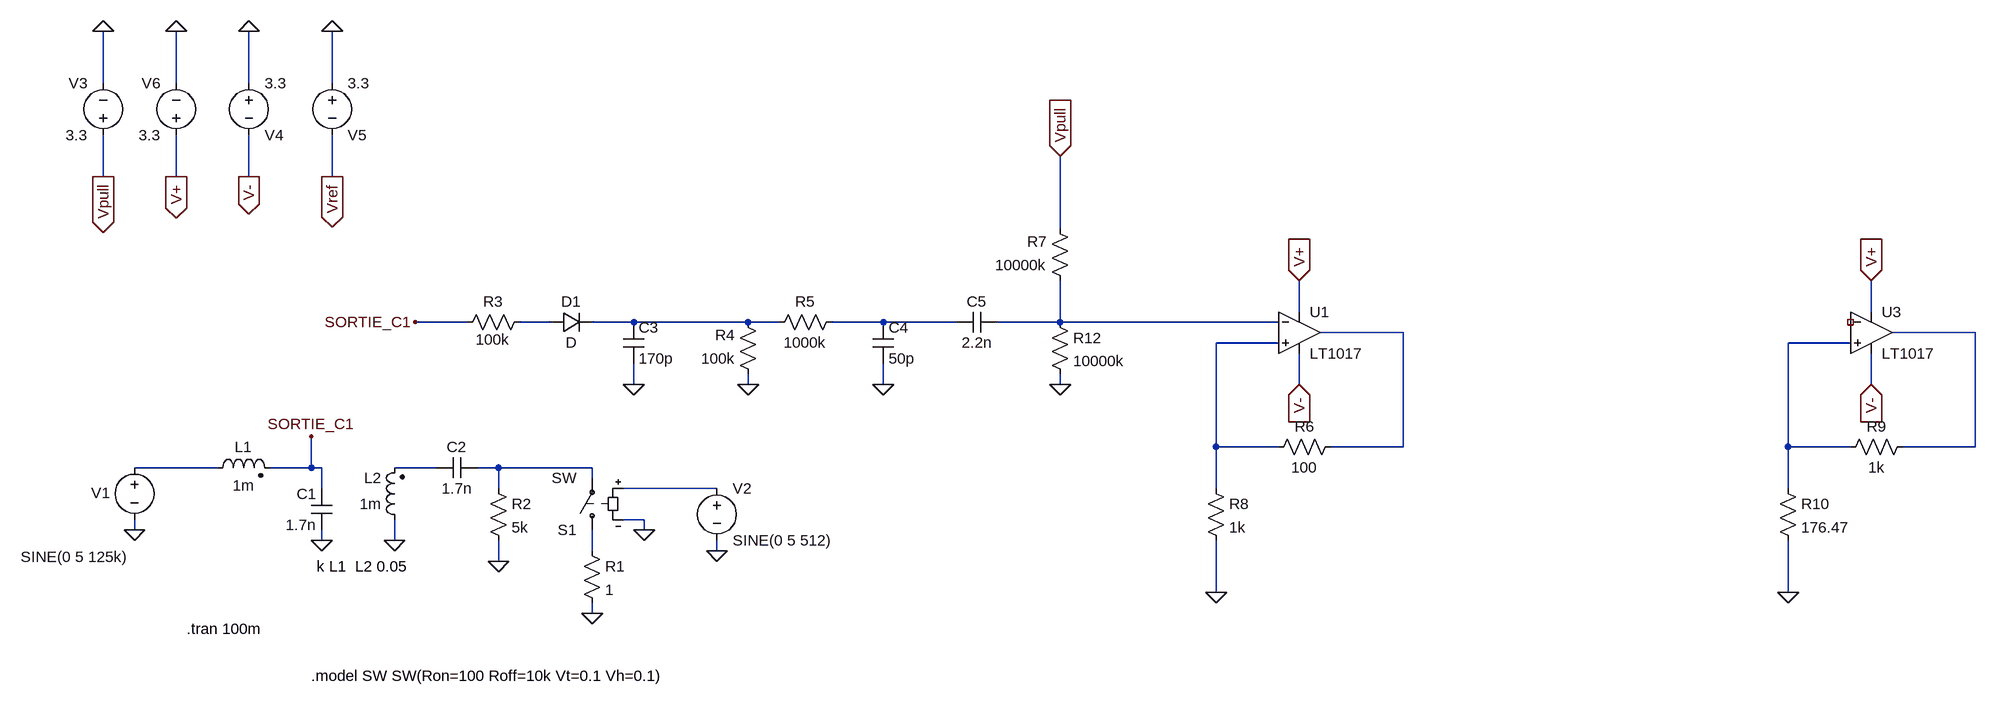
[diagram p0: schematic Simulation_Badge.asc]
Simulation_Badge.asc, the LTspice schematic file:
Version 4
SHEET 1 2924 680
WIRE -224 -528 -224 -608
WIRE -112 -528 -112 -608
WIRE 0 -528 0 -608
WIRE 128 -528 128 -608
WIRE -224 -384 -224 -448
WIRE -112 -384 -112 -448
WIRE 0 -384 0 -448
WIRE 128 -384 128 -448
WIRE 1248 -304 1248 -416
WIRE 1616 -176 1616 -224
WIRE 2496 -176 2496 -224
WIRE 336 -160 256 -160
WIRE 464 -160 416 -160
WIRE 592 -160 528 -160
WIRE 768 -160 592 -160
WIRE 816 -160 768 -160
WIRE 976 -160 896 -160
WIRE 1088 -160 976 -160
WIRE 1248 -160 1248 -224
WIRE 1248 -160 1152 -160
WIRE 1584 -160 1248 -160
WIRE 1776 -144 1648 -144
WIRE 2656 -144 2528 -144
WIRE 1584 -128 1488 -128
WIRE 2464 -128 2368 -128
WIRE 592 -64 592 -96
WIRE 768 -64 768 -80
WIRE 976 -64 976 -96
WIRE 1248 -64 1248 -80
WIRE 1616 -64 1616 -112
WIRE 2496 -64 2496 -112
WIRE 1488 32 1488 -128
WIRE 1584 32 1488 32
WIRE 1776 32 1776 -144
WIRE 1776 32 1664 32
WIRE 2368 32 2368 -128
WIRE 2464 32 2368 32
WIRE 2656 32 2656 -144
WIRE 2656 32 2544 32
WIRE -48 64 -176 64
WIRE 96 64 96 16
WIRE 96 64 32 64
WIRE 112 64 96 64
WIRE 288 64 224 64
WIRE 384 64 352 64
WIRE 528 64 384 64
WIRE 528 80 528 64
WIRE 112 96 112 64
WIRE 384 96 384 64
WIRE 720 96 576 96
WIRE 1488 96 1488 32
WIRE 2368 96 2368 32
WIRE 608 144 576 144
WIRE -176 160 -176 144
WIRE 608 160 608 144
WIRE 112 176 112 160
WIRE 224 176 224 144
WIRE 528 192 528 160
WIRE 720 192 720 176
WIRE 384 208 384 176
WIRE 1488 256 1488 176
WIRE 2368 256 2368 176
WIRE 528 288 528 272
FLAG 608 160 0
FLAG -176 160 0
FLAG 112 176 0
FLAG 224 176 0
FLAG 720 192 0
FLAG 528 288 0
FLAG 384 208 0
FLAG 96 16 SORTIE_C1
FLAG 256 -160 SORTIE_C1
FLAG 592 -64 0
FLAG 768 -64 0
FLAG 976 -64 0
FLAG 1248 -64 0
FLAG -224 -608 0
FLAG 0 -608 0
FLAG -224 -384 Vpull
IOPIN -224 -384 Out
FLAG 0 -384 V-
IOPIN 0 -384 Out
FLAG 1248 -416 Vpull
IOPIN 1248 -416 In
FLAG 128 -608 0
FLAG 128 -384 Vref
IOPIN 128 -384 Out
FLAG -112 -608 0
FLAG -112 -384 V+
IOPIN -112 -384 Out
FLAG 2496 -224 V+
IOPIN 2496 -224 In
FLAG 2496 -64 V-
IOPIN 2496 -64 In
FLAG 2368 256 0
FLAG 1616 -224 V+
IOPIN 1616 -224 In
FLAG 1616 -64 V-
IOPIN 1616 -64 In
FLAG 1488 256 0
SYMBOL ind2 -64 80 R270
WINDOW 0 32 56 VTop 2
WINDOW 3 4 56 VBottom 2
SYMATTR InstName L1
SYMATTR Value 1m
SYMATTR Type ind
SYMATTR SpiceLine Rser=57
SYMBOL ind2 240 160 R180
WINDOW 0 36 80 Left 2
WINDOW 3 36 40 Left 2
SYMATTR InstName L2
SYMATTR Value 1m
SYMATTR Type ind
SYMATTR SpiceLine Rser=57
SYMBOL cap 128 160 R180
WINDOW 0 24 56 Left 2
WINDOW 3 24 8 Left 2
SYMATTR InstName C1
SYMATTR Value 1.7n
SYMBOL sw 528 176 R180
SYMATTR InstName S1
SYMBOL voltage -176 48 R0
WINDOW 3 -175 153 Left 2
WINDOW 123 0 0 Left 0
WINDOW 39 0 0 Left 0
WINDOW 0 -67 55 Left 2
SYMATTR Value SINE(0 5 125k)
SYMATTR InstName V1
SYMBOL voltage 720 80 R0
WINDOW 123 0 0 Left 0
WINDOW 39 0 0 Left 0
SYMATTR InstName V2
SYMATTR Value SINE(0 5 512)
SYMBOL res 512 176 R0
SYMATTR InstName R1
SYMATTR Value 1
SYMBOL res 368 80 R0
SYMATTR InstName R2
SYMATTR Value 5k
SYMBOL cap 352 48 R90
WINDOW 0 0 32 VBottom 2
WINDOW 3 32 32 VTop 2
SYMATTR InstName C2
SYMATTR Value 1.7n
SYMBOL res 432 -176 R90
WINDOW 0 0 56 VBottom 2
WINDOW 3 58 57 VBottom 2
SYMATTR InstName R3
SYMATTR Value 100k
SYMBOL diode 464 -144 R270
WINDOW 0 32 32 VTop 2
WINDOW 3 0 32 VBottom 2
SYMATTR InstName D1
SYMBOL cap 576 -160 R0
SYMATTR InstName C3
SYMATTR Value 170p
SYMBOL res 784 -64 R180
WINDOW 0 36 76 Left 2
WINDOW 3 36 40 Left 2
SYMATTR InstName R4
SYMATTR Value 100k
SYMBOL cap 960 -160 R0
SYMATTR InstName C4
SYMATTR Value 50p
SYMBOL res 912 -176 R90
WINDOW 0 0 56 VBottom 2
WINDOW 3 32 56 VTop 2
SYMATTR InstName R5
SYMATTR Value 1000k
SYMBOL cap 1152 -176 R90
WINDOW 0 0 32 VBottom 2
WINDOW 3 32 32 VTop 2
SYMATTR InstName C5
SYMATTR Value 2.2n
SYMBOL res 1232 -176 R0
SYMATTR InstName R12
SYMATTR Value 10000k
SYMBOL res 1264 -208 R180
WINDOW 0 36 76 Left 2
WINDOW 3 36 40 Left 2
SYMATTR InstName R7
SYMATTR Value 10000k
SYMBOL voltage -224 -432 R180
WINDOW 0 24 96 Left 2
WINDOW 3 24 16 Left 2
WINDOW 123 0 0 Left 0
WINDOW 39 0 0 Left 0
SYMATTR InstName V3
SYMATTR Value 3.3
SYMBOL voltage 0 -544 R0
WINDOW 0 24 96 Left 2
WINDOW 3 24 16 Left 2
WINDOW 123 0 0 Left 0
WINDOW 39 0 0 Left 0
SYMATTR InstName V4
SYMATTR Value 3.3
SYMBOL voltage 128 -544 R0
WINDOW 0 24 96 Left 2
WINDOW 3 24 16 Left 2
WINDOW 123 0 0 Left 0
WINDOW 39 0 0 Left 0
SYMATTR InstName V5
SYMATTR Value 3.3
SYMBOL voltage -112 -432 R180
WINDOW 0 24 96 Left 2
WINDOW 3 24 16 Left 2
WINDOW 123 0 0 Left 0
WINDOW 39 0 0 Left 0
SYMATTR InstName V6
SYMATTR Value 3.3
SYMBOL res 2560 16 R90
WINDOW 0 0 56 VBottom 2
WINDOW 3 32 56 VTop 2
SYMATTR InstName R9
SYMATTR Value 1k
SYMBOL res 2352 80 R0
SYMATTR InstName R10
SYMATTR Value 176.47
SYMBOL Comparators\\LT1017 2496 -144 R0
SYMATTR InstName U3
SYMBOL res 1680 16 R90
WINDOW 0 0 56 VBottom 2
WINDOW 3 32 56 VTop 2
SYMATTR InstName R6
SYMATTR Value 100
SYMBOL res 1472 80 R0
SYMATTR InstName R8
SYMATTR Value 1k
SYMBOL Comparators\\LT1017 1616 -144 R0
SYMATTR InstName U1
TEXT 104 216 Left 2 !k L1  L2 0.05
TEXT -96 312 Left 2 !.tran 100m
TEXT 96 384 Left 2 !.model SW SW(Ron=100 Roff=10k Vt=0.1 Vh=0.1)

The netlist it stands for:
* Simulation_Badge.asc
L1 N009 SORTIE_C1 1m Rser=57
L2 0 N010 1m Rser=57
C1 0 SORTIE_C1 1.7n
S1 N013 N011 N012 0 SW
V1 N009 0 SINE(0 5 125k)
V2 N012 0 SINE(0 5 512)
R1 N013 0 1
R2 N011 0 5k
C2 N011 N010 1.7n
R3 N001 SORTIE_C1 100k
D1 N001 N002 D
C3 N002 0 170p
R4 0 N002 100k
C4 N003 0 50p
R5 N003 N002 1000k
C5 N004 N003 2.2n
R12 N004 0 10000k
R7 N004 Vpull 10000k
V3 Vpull 0 3.3
V4 0 V- 3.3
V5 0 Vref 3.3
V6 V+ 0 3.3
R9 N006 N008 1k
R10 N008 0 176.47
XU3 N008 NC_01 V+ V- N006 LT1017  ; pins In+ In- V+ V- OUT
R6 N005 N007 100
R8 N007 0 1k
XU1 N007 N004 V+ V- N005 LT1017  ; pins In+ In- V+ V- OUT
.model D D
.lib standard.dio
k L1  L2 0.05
.tran 100m
.model SW SW(Ron=100 Roff=10k Vt=0.1 Vh=0.1)
.backanno
.end